# EAGLE design minipov3 (EAGLE 5.07)
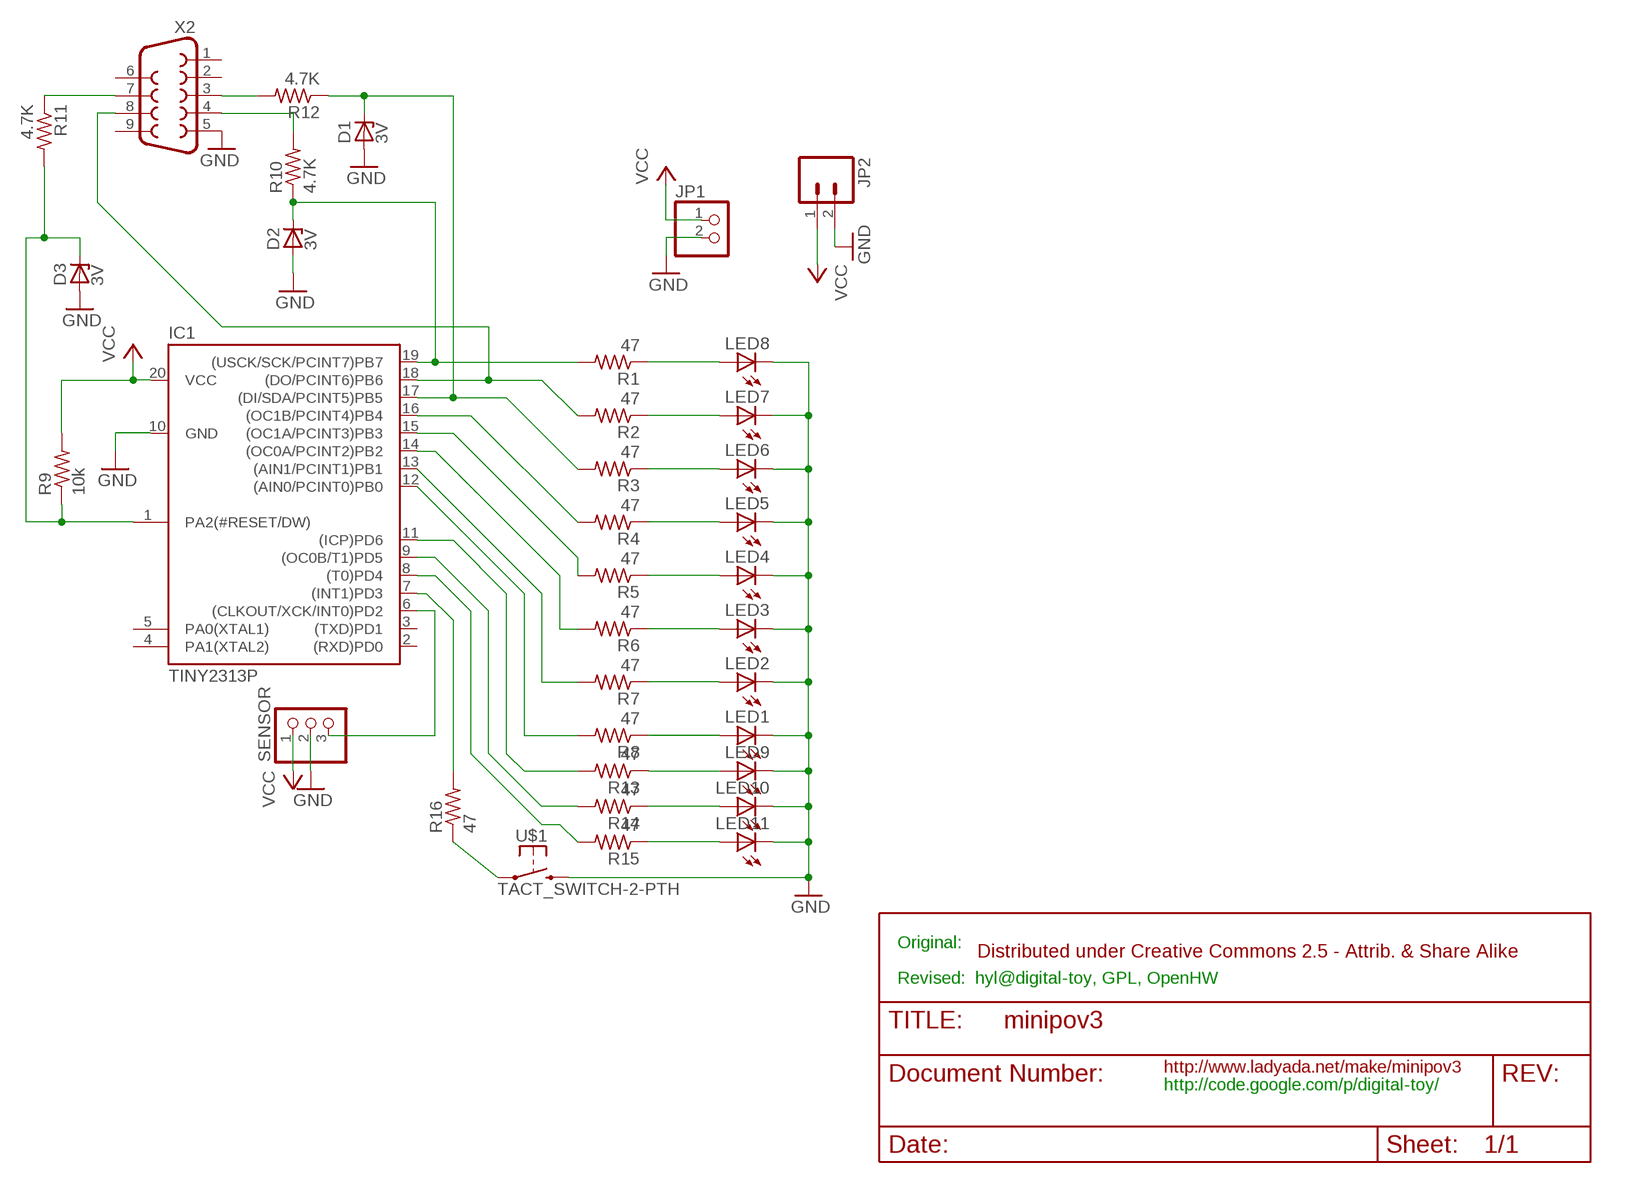
[diagram p0: schematic, sheet 1]

## Parts
D1  3V  ZENER-DIODEDO35Z10  [DO35Z10]
D2  3V  ZENER-DIODEDO35Z10  [DO35Z10]
D3  3V  ZENER-DIODEDO34-7  [DO34Z7]
IC1  TINY2313P  [DIL20]
JP1  PINHD-1X2  [1X02]
JP2  CON-02LOCK_LONGPADS  [1X02_LOCK_LONGPADS]
LED1  LED5MM  [LED5MM]
LED2  LED5MM  [LED5MM]
LED3  LED5MM  [LED5MM]
LED4  LED5MM  [LED5MM]
LED5  LED5MM  [LED5MM]
LED6  LED5MM  [LED5MM]
LED7  LED5MM  [LED5MM]
LED8  LED5MM  [LED5MM]
LED9  LED5MM  [LED5MM]
LED10  LED5MM  [LED5MM]
LED11  LED5MM  [LED5MM]
R1  47  R-US_0207/10  [0207/10]
R2  47  R-US_0207/10  [0207/10]
R3  47  R-US_0207/10  [0207/10]
R4  47  R-US_0207/10  [0207/10]
R5  47  R-US_0207/10  [0207/10]
R6  47  R-US_0207/10  [0207/10]
R7  47  R-US_0207/10  [0207/10]
R8  47  R-US_0207/10  [0207/10]
R9  10k  R-US_0207/10  [0207/10]
R10  4.7K  R-US_0207/10  [0207/10]
R11  4.7K  R-US_0207/10  [0207/10]
R12  4.7K  R-US_0207/10  [0207/10]
R13  47  R-US_0207/10  [0207/10]
R14  47  R-US_0207/10  [0207/10]
R15  47  R-US_0207/10  [0207/10]
R16  47  R-US_0207/10  [0207/10]
SENSOR  PINHD-1X3  [1X03]
U$1  TACT_SWITCH-2-PTH  [ALPS-SKHV]
X2  F09HP  [F09HP]

## Nets
GND: D1.A D2.A D3.A IC1.10(GND) JP1.2 JP2.2 LED1.K(C) LED2.K(C) LED3.K(C) LED4.K(C) LED5.K(C) LED6.K(C) LED7.K(C) LED8.K(C) LED9.K(C) LED10.K(C) LED11.K(C) SENSOR.2 U$1.3 X2.5
N$1: D3.C IC1.1(PA2(#RESET/DW)) R9.1 R11.2
N$2: D1.C IC1.17((DI/SDA/PCINT5)PB5) R3.2 R12.1
N$3: R12.2 X2.3
N$4: R11.1 X2.7
N$5: IC1.11((ICP)PD6) R13.2
N$6: LED9.A R13.1
N$7: R10.2 X2.4
N$8: LED8.A R1.1
N$9: LED7.A R2.1
N$10: LED6.A R3.1
N$11: LED5.A R4.1
N$12: LED4.A R5.1
N$13: LED3.A R6.1
N$14: LED2.A R7.1
N$15: LED1.A R8.1
N$16: IC1.16((OC1B/PCINT4)PB4) R4.2
N$17: IC1.15((OC1A/PCINT3)PB3) R5.2
N$18: IC1.14((OC0A/PCINT2)PB2) R6.2
N$19: IC1.13((AIN1/PCINT1)PB1) R7.2
N$20: IC1.12((AIN0/PCINT0)PB0) R8.2
N$21: IC1.6((CLKOUT/XCK/INT0)PD2) SENSOR.3
N$22: D2.C IC1.19((USCK/SCK/PCINT7)PB7) R1.2 R10.1
N$23: LED10.A R14.1
N$24: LED11.A R15.1
N$25: IC1.9((OC0B/T1)PD5) R14.2
N$26: IC1.8((T0)PD4) R15.2
N$28: R16.1 U$1.2
N$29: IC1.7((INT1)PD3) R16.2
R12: IC1.18((DO/PCINT6)PB6) R2.2 X2.8
VCC: IC1.20(VCC) JP1.1 JP2.1 R9.2 SENSOR.1
Unconnected: IC1.2((RXD)PD0) IC1.3((TXD)PD1) IC1.4(PA1(XTAL2)) IC1.5(PA0(XTAL1)) X2.1 X2.2 X2.6 X2.9

## Notes on the sheet
- Original:
- Distributed under Creative Commons 2.5 - Attrib. & Share Alike
- Revised:  hyl@digital-toy, GPL, OpenHW
- http://www.ladyada.net/make/minipov3
- http://code.google.com/p/digital-toy/

## Library data of the parts
D1-D3 = diode:ZENER-DIODE: Z-Diode
IC1 = minipov:TINY2313: 8-bit AVR Microcontroller with 2K Bytes Flash Source: http://www.atmel.com .. doc1477.pdf
JP1 = pinhead:PINHD-1X2: PIN HEADER
JP2 = digital-toy:CON-02: Header 2 Standard 2-pin 0.1" header. Use with straight break away headers (SKU : PRT-00116), right angle break away headers (PRT-00553), swiss pins (PRT-00743), machine pins (PRT-00117), and female headers (PRT-00115). Molex polarized connector foot print use with SKU : PRT-08233 with associated crimp pins and housings.
LED1-LED11 = minipov:LED: LED OSRAM: - CHIPLED LG R971, LG N971, LY N971, LG Q971, LY Q971, LO R971, LY R971 LH N974, LH R974 LS Q976, LO Q976, LY Q976 LO Q996 - Hyper CHIPLED LW Q18S LB Q993, LB Q99A, LB R99A - SideLED LS A670, LO A670, LY A670, LG A670, LP A670 LB A673, LV A673, LT A673, LW A673 LH A674 LY A675 LS A676, LA A676, LO A676, LY A676, LW A676 LS A679, LY A679, LG A679 - Hyper Micro SIDELED® LS Y876, LA Y876, LO Y876, LY Y876 LT Y87S - SmartLED LW L88C, LW L88S LB L89C, LB L89S, LG L890 LS L89K, LO L89K, LY L89K LS L896, LA L896, LO L896, LY L896 - TOPLED LS T670, LO T670, LY T670, LG T670, LP T670 LSG T670, LSP T670, LSY T670, LOP T670, LYG T670 LG T671, LOG T671, LSG T671 LB T673, LV T673, LT T673, LW T673 LH T674 LS T676, LA T676, LO T676, LY T676, LB T676, LH T676, LSB T676, LW T676 LB T67C, LV T67C, LT T67C, LS T67K, LO T67K, LY T67K, LW E67C LS E67B, LA E67B, LO E67B, LY E67B, LB E67C, LV E67C, LT E67C LW T67C LS T679, LY T679, LG T679 LS T770, LO T770, LY T770, LG T770, LP T770 LB T773, LV T773, LT T773, LW T773 LH T774 LS E675, LA E675, LY E675, LS T675 LS T776, LA T776, LO T776, LY T776, LB T776 LHGB T686 LT T68C, LB T68C - Hyper Mini TOPLED® LB M676 - Mini TOPLED Santana® LG M470 LS M47K, LO M47K, LY M47K Source: http://www.osram.convergy.de/
R1-R16 = minipov:R-US_: RESISTOR, American symbol
SENSOR = pinhead:PINHD-1X3: PIN HEADER
U$1 = digital-toy:TACT_SWITCH-2
X2 = con-subd:F09: SUB-D

## Board
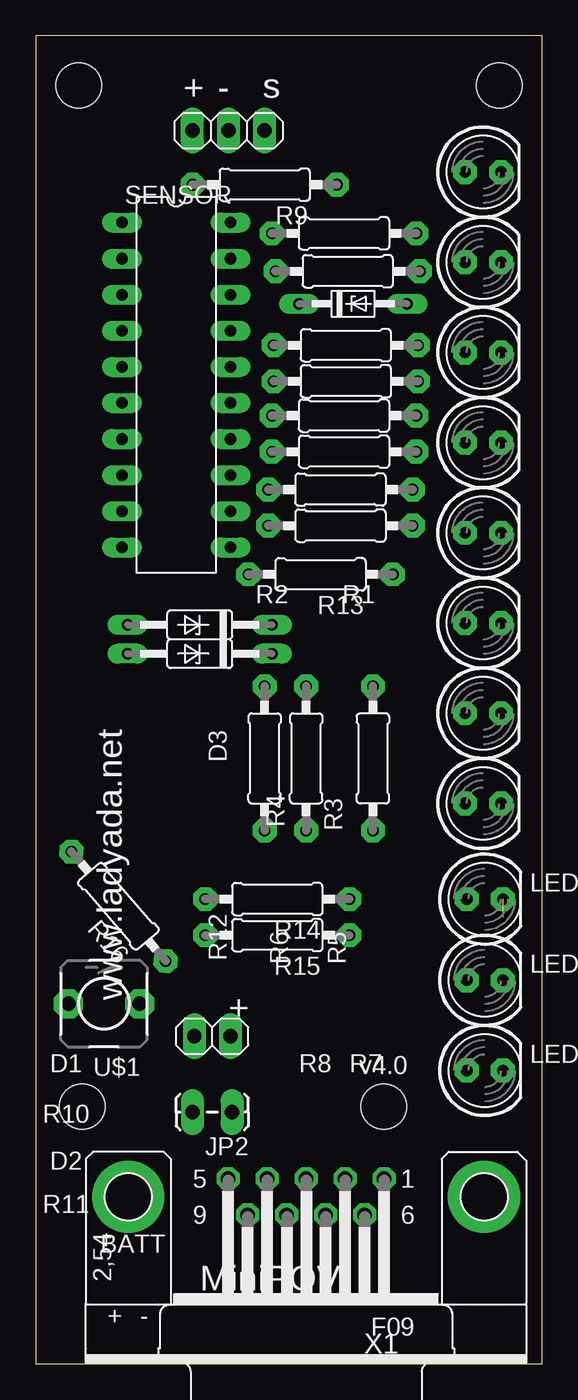
[diagram p1: board, top side]
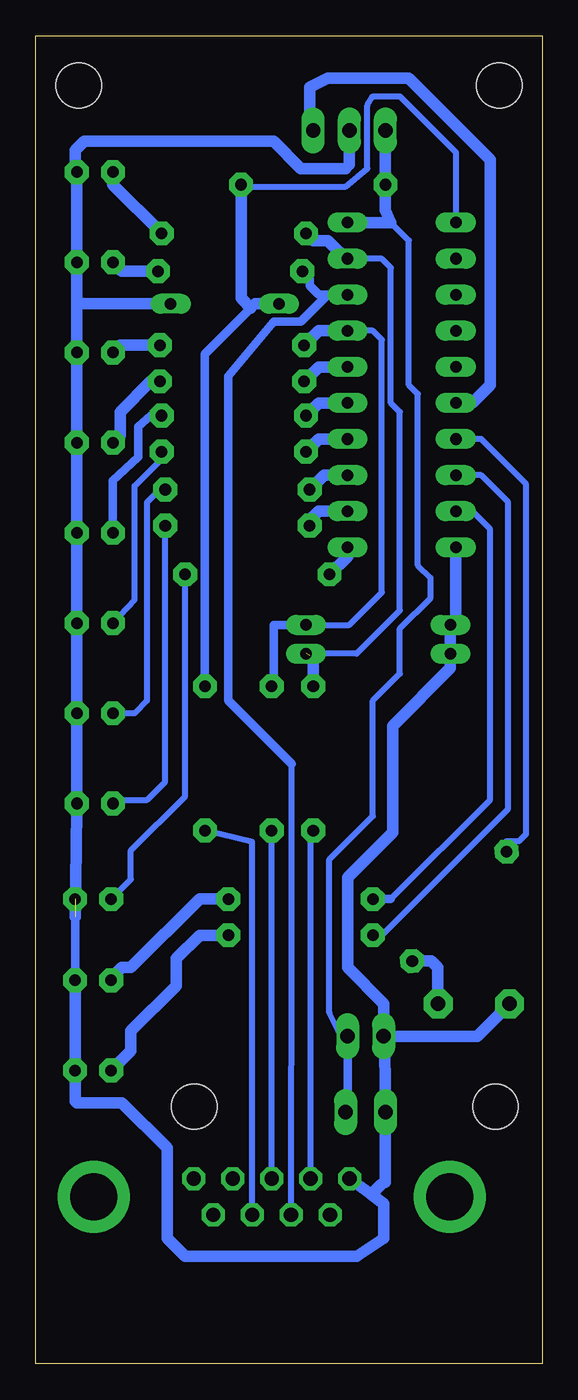
[diagram p2: board, bottom side, seen from below]

Size 35.67 x 93.52 mm. Coordinates in mm from the lower left corner, seen from the top.
Outline: 0,0 35.67,0 35.67,93.52 0,93.52 0,0
Copper layers (1*16): Top 0.035mm / dielectric 1.5mm / Bottom 0.035mm
Design rules "SparkFun": minimum track width 8mil, minimum drill 20mil, track to track 8mil, track to pad 8mil, pad to pad 8mil, via to via 8mil, smd to smd 8mil, copper to edge 10mil, drill to drill 8mil, minimum pad ring 12mil, minimum via ring 10mil, stop-mask expansion 4mil, vias tented up to drill 25mil, thermal gap 10mil
Holes 3.2 mm at 3.04,90.01 3.3,18.12 32.63,90.01 24.51,18.12

### Footprints (pad centres in the part's own frame; a part is rotated, then mirrored left to right if it is on the bottom)
DO35Z10 = drill 0.813 long: A 5.08,0; C -5.08,0
DO34Z7 = drill 0.813 long: A 3.81,0; C -3.81,0
DIL20 = drill 0.813 long: 1 -11.43,-3.81; 2 -8.89,-3.81; 3 -6.35,-3.81; 4 -3.81,-3.81; 5 -1.27,-3.81; 6 1.27,-3.81; 7 3.81,-3.81; 8 6.35,-3.81; 9 8.89,-3.81; 10 11.43,-3.81; 11 11.43,3.81; 12 8.89,3.81; 13 6.35,3.81; 14 3.81,3.81; 15 1.27,3.81; 16 -1.27,3.81; 17 -3.81,3.81; 18 -6.35,3.81; 19 -8.89,3.81; 20 -11.43,3.81
1X02 = drill 1.016 long: 1 -1.27,0; 2 1.27,0
1X02_LOCK_LONGPADS = drill 1.016 long: 1 -0.127,0; 2 2.667,0
LED5MM = drill 0.813 pad 1.676 octagon: A -1.27,0; K 1.27,0
0207/10 = drill 0.813 pad 1.676 octagon: 1 -5.08,0; 2 5.08,0
1X03 = drill 1.016 long: 1 -2.54,0; 2 0,0; 3 2.54,0
ALPS-SKHV = drill 1.016 pad 2.032 octagon: 2 -2.51,0; 3 2.51,0
F09HP = drill 1.016 octagon: 1 -5.486,-1.27; 2 -2.743,-1.27; 3 0,-1.27; 4 2.743,-1.27; 5 5.486,-1.27; 6 -4.115,1.27; 7 -1.372,1.27; 8 1.372,1.27; 9 4.115,1.27 | drill 3.302 pad 5.08 round: G1 -12.522,0; G2 12.522,0

### Placement (x,y rotation side)
D1  5.1  [DO35Z10]  11.55,52.03 180 top
D2  5.1  [DO35Z10]  11.55,50 180 top
D3  5.1V  [DO34Z7]  22.35,74.64 0 top
IC1  9.9,68.92 270 top
JP1  12.44,23.08 180 top
JP2  13.71,17.74 180 top
LED1  31.49,39.46 0 top
LED2  31.49,45.81 0 top
LED3  31.49,52.16 0 top
LED4  31.49,58.51 0 top
LED5  31.49,64.86 0 top
LED6  31.49,71.21 0 top
LED7  31.49,77.56 0 top
LED8  31.49,83.91 0 top
LED9  31.62,32.73 0 top
LED10  31.62,27.01 0 top
LED11  31.62,20.66 0 top
R1  47/100  [0207/10]  21.71,79.59 180 top
R2  100  [0207/10]  21.97,76.92 180 top
R3  100  [0207/10]  21.84,71.72 180 top
R4  100  [0207/10]  21.84,69.18 180 top
R5  100  [0207/10]  21.71,66.76 180 top
R6  100  [0207/10]  21.71,64.22 180 top
R7  100  [0207/10]  21.46,61.56 180 top
R8  100  [0207/10]  21.46,59.02 180 top
R9  16.12,83.02 180 top
R10  16.12,42.63 270 top
R11  23.74,42.63 90 top
R12  19.04,42.63 270 top
R13  100  [0207/10]  20.06,55.59 180 top
R14  100  [0207/10]  17.01,32.73 180 top
R15  100  [0207/10]  17.01,30.19 180 top
R16  5.84,32.22 130.8 top
SENSOR  13.58,86.83 0 top
U$1  4.82,25.36 180 top
X2  19.04,11.77 180 top

### Tracks (layer width: path | path; a pad name or v marks a point on that pad's centre or on a via)
GND  (1 unrouted)
  Bottom 0.406: LED4.K 32.76,58.26 | 13.84,84.16 13.58,84.42 | 32.76,38.95 LED1.K | LED8.K 32.89,84.04 | 11.04,12.79 11.16,12.65 11.33,12.65
  Bottom 0.61: LED10.K LED9.K | 32.76,18.38 32.89,18.5
  Bottom 0.813: LED8.K LED7.K 32.76,74.64 | 32.76,74.64 LED6.K LED5.K LED4.K LED3.K LED2.K LED1.K | IC1.10 6.09,52.41 D1.A D2.A 6.47,48.98 10.54,44.92 10.54,37.43 13.71,34.25 13.71,27.9 11.17,25.36 JP1.2 | 32.76,74.64 D3.A | 13.58,84.42 SENSOR.2 | 32.89,31.46 32.76,38.95 | 13.84,84.16 17.01,84.16 18.92,86.07 32.25,86.07 32.89,85.43 32.89,84.04 | LED10.K LED11.K 32.89,18.5 | JP1.2 11.04,20.41 JP2.2 11.04,12.79 | U$1.3 4.6,23.08 JP1.2 | 12.04,11.93 11.17,11.29 11.17,8.85 13.08,7.58 25.14,7.58 26.41,8.85 26.41,15.2 29.59,18.38 32.76,18.38 | 12.04,11.93 X2.5 | 12.04,11.93 11.33,12.65
N$1
  Bottom 0.406: 20.51,74.32 20.19,74.64 | IC1.1 6.09,85.31 10.03,89.24 11.93,89.24 12.31,88.61 12.31,84.16 13.84,82.89 21.08,82.89 R9.1
  Bottom 0.61: R11.2 23.74,71.08 20.51,74.32
  Bottom 0.813: R9.1 21.2,75.02 20.51,74.32 | 20.19,74.64 D3.C
N$2
  Bottom 0.406: D1.C 13.58,52.03 11.3,54.32 11.3,72.1 11.93,72.73 IC1.17
  Bottom 0.61: R12.1 18.92,48.6 18.92,52.03 D1.C
  Bottom 0.813: IC1.17 15.74,72.73 R3.2
N$3
  Bottom 0.406: X2.3 R12.2
N$4
  Bottom 0.406: X2.7 20.42,36.77 R11.1
N$5
  Bottom 0.61: 13.71,56.86 IC1.11
  Bottom 0.813: R13.2 13.71,56.86
N$6
  Bottom 0.406: R13.1 25.14,39.97 28.95,36.16 28.95,34.12 LED9.A
N$7
  Bottom 0.406: X2.4 16.3,37.38 R10.2
N$8
  Bottom 0.813: R1.1 30.22,83.02 LED8.A
N$9
  Bottom 0.813: R2.1 29.59,76.92 LED7.A
N$10
  Bottom 0.813: R3.1 29.71,71.72 LED6.A
N$11
  Bottom 0.813: R4.1 27.55,69.18 29.71,67.02 29.71,65.37 LED5.A
N$12
  Bottom 0.406: 27.55,66.76 R5.1
  Bottom 0.61: LED4.A 30.22,62.19 28.44,63.84 28.44,66 27.55,66.76
N$13
  Bottom 0.406: LED3.A 28.7,53.81 28.7,61.81 26.79,63.72 R6.1
N$14
  Bottom 0.406: LED2.A 28.7,45.81 27.81,46.7 27.81,60.67 27.17,61.3 26.79,61.3 R7.1
N$15
  Bottom 0.406: R8.1 26.54,40.98 27.81,39.71 29.97,39.71 LED1.A
N$16
  Bottom 0.813: IC1.16 15.74,70.19 R4.2
N$17
  Bottom 0.813: IC1.15 15.74,67.65 R5.2
N$18
  Bottom 0.813: IC1.14 15.74,65.11 R6.2
N$19
  Bottom 0.813: IC1.13 15.36,62.57 R7.2
N$20
  Bottom 0.406: 16.38,59.4 17.01,58.76
  Bottom 0.813: IC1.12 15.74,60.03 16.38,59.4 R8.2
N$21
  Bottom 0.813: IC1.6 4.95,67.65 3.68,68.92 3.68,84.8 9.39,90.51 15.11,90.51 16.38,89.88 16.38,87.85 SENSOR.3
N$22  (1 unrouted)
  Bottom 0.406: D2.C 13.08,50 10.03,53.05 10.03,67.02 10.66,67.65 10.66,77.18 11.3,77.81 IC1.19 13.84,77.81
  Bottom 0.61: 16.12,49.62 16.38,49.87
  Bottom 0.813: R10.1 16.12,49.62 | 13.84,77.81 15.11,79.08 16.12,79.08 R1.2
N$23
  Bottom 0.406: 30.22,27.27 30.6,27.27 | 30.6,27.27 30.86,27.27 | 30.6,27.27 LED10.A
  Bottom 0.813: R14.1 24.12,32.73 28.95,27.9 29.59,27.9 30.22,27.27
N$24
  Bottom 0.813: R15.1 24.12,30.19 25.78,28.54 25.78,26.63 28.95,23.46 28.95,22.06 LED11.A
N$25
  Bottom 0.406: IC1.9 4.95,60.03 3.68,58.76 3.68,39.71 10.66,32.73
  Bottom 0.61: R14.2 10.66,32.73
N$26
  Bottom 0.406: R15.2 11.3,30.19 2.41,39.08 2.41,60.67 4.31,62.57 IC1.8
N$28
  Bottom 0.406: U$1.2 7.36,25.36
  Bottom 0.813: 7.36,25.36 7.36,27.9 7.83,28.37 R16.1
N$29
  Bottom 0.406: IC1.7 4.31,65.11 1.14,61.94 1.14,37.3 1.65,36.79 2.52,36.79 R16.2 2.28,35.65
R12
  Bottom 0.406: 17.65,42.25 17.65,31.48 X2.8
  Bottom 0.61: R2.2 16.38,76.42 16.38,75.91 15.74,75.27 IC1.18 15.11,75.27 17.01,73.37 18.92,73.37 22.09,69.56 22.09,46.7 17.65,42.25
VCC
  Bottom 0.406: 10.66,80.35 9.39,79.08 9.39,68.92 8.76,68.29 8.76,56.22 7.87,55.33 7.87,53.94 10.03,51.78 10.03,48.6 11.93,46.7 11.93,38.57 14.98,35.52 14.98,24.73 14.35,23.46 13.71,22.31 JP1.1 | R9.2 11.04,83.15
  Bottom 0.61: JP1.1 13.71,16.6 JP2.1
  Bottom 0.813: IC1.20 10.66,80.35 11.04,81.24 R9.2 | 11.04,83.15 SENSOR.1

### Text on the board
tPlace: + | - | s | + | v4.0
tNames: R2 | R1 | D3 | R4 | R3 | R6 | R5 | R12 | www.ladyada.net | R8 | R7 | D1 | R10 | D2 | R11 | BATT | MiniPOV! | + | - | X1